# Altium schematic sheet PWMBoard.SchDoc
size B
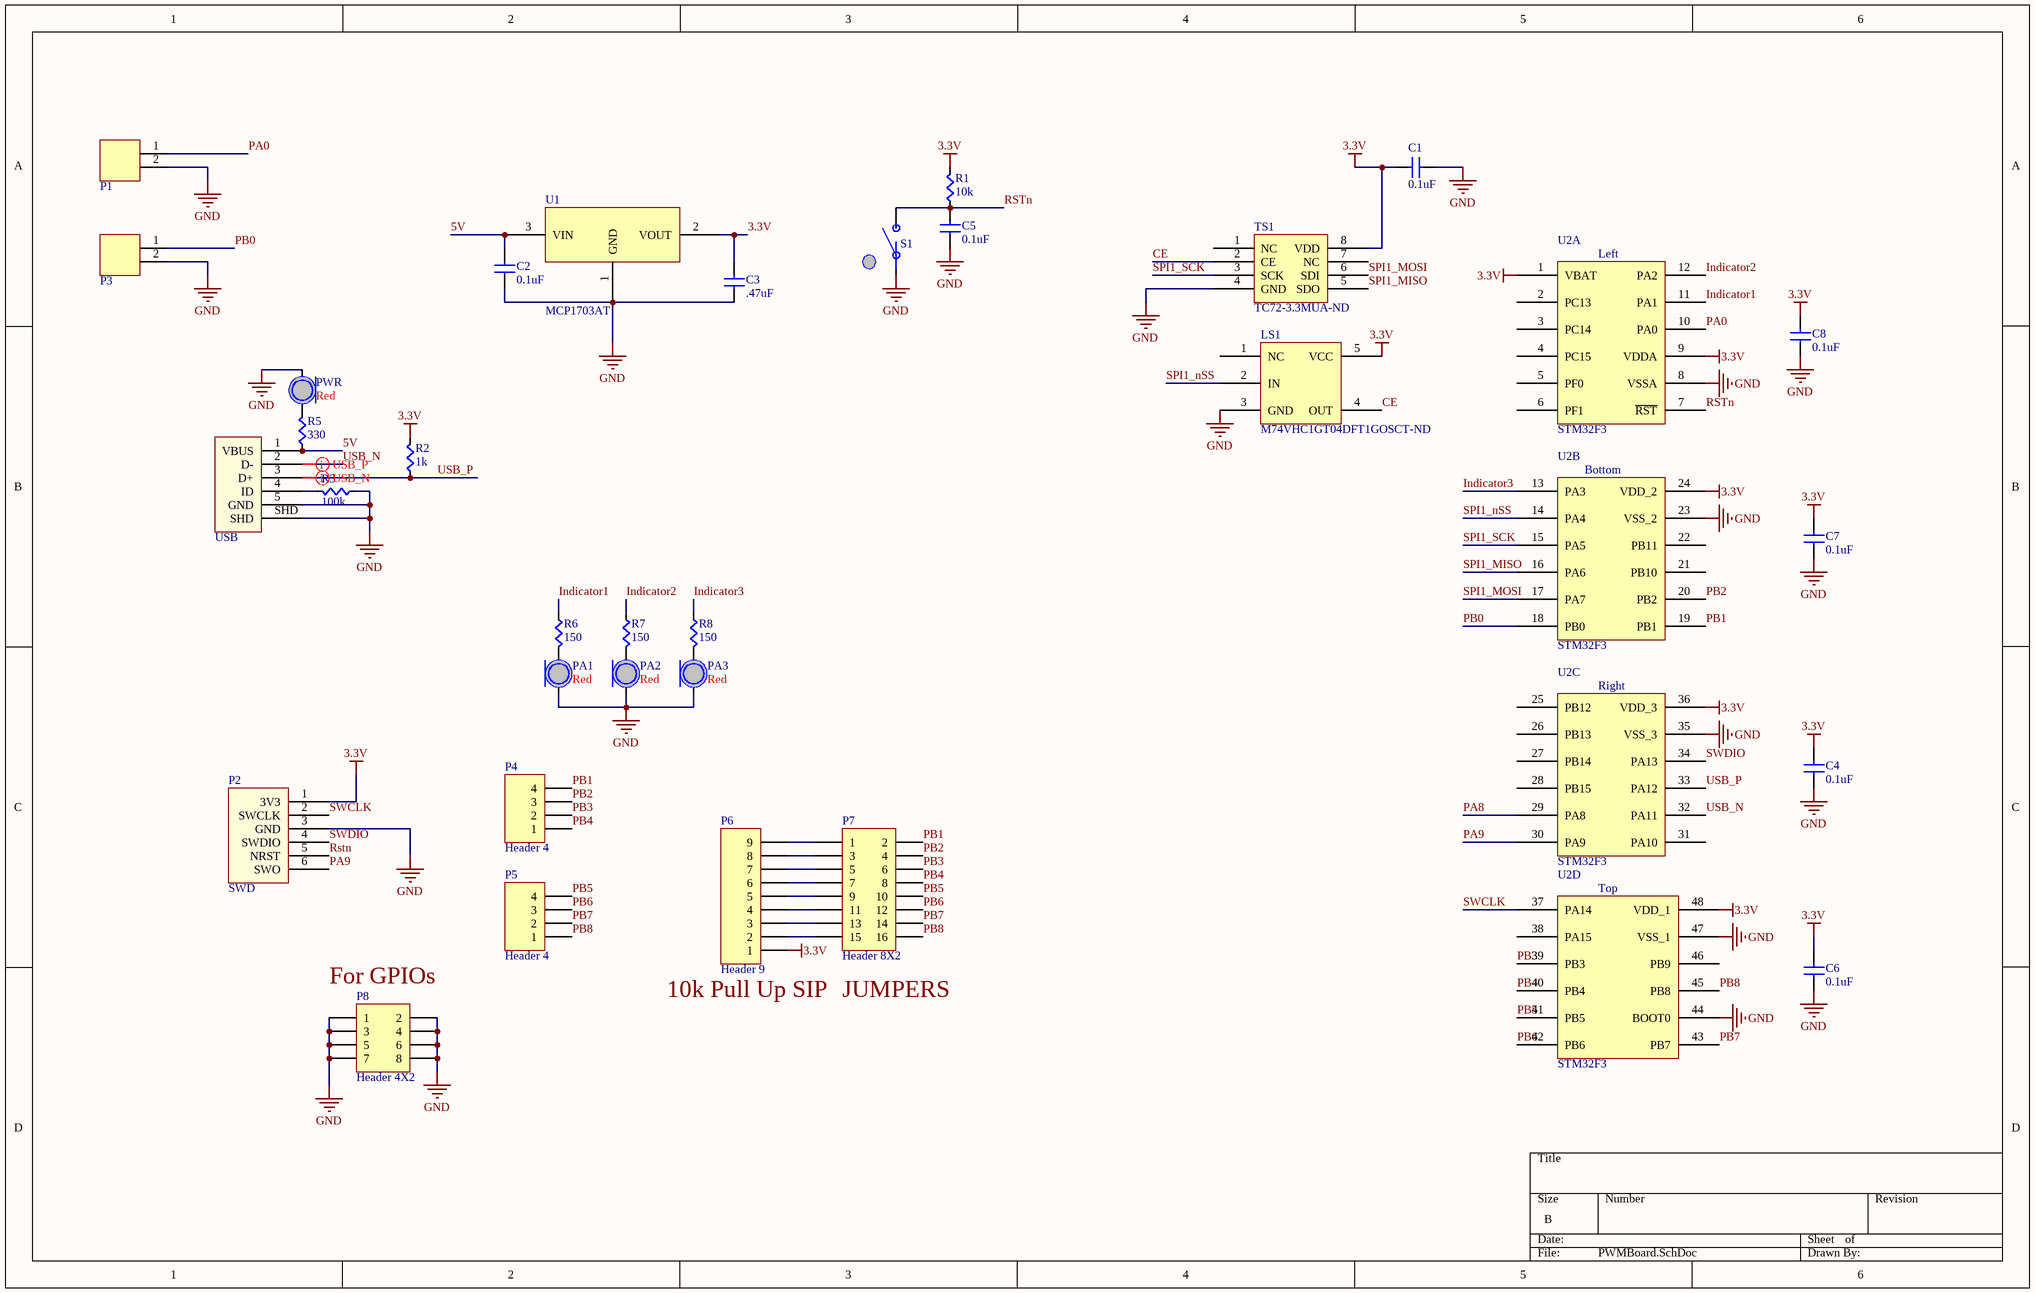
[diagram p0: PWMBoard.SchDoc]

## Parts
C1  value 0.1uF  [CAPC0603]  (hidden comment: Cap)
C2  value 0.1uF  [CAPC0603]  (hidden comment: Cap)
C3  value .47uF  [CAPC0603]  (hidden comment: Cap)
C4  value 0.1uF  [CAPC0603]  (hidden comment: Cap)
C5  value 0.1uF  [CAPC0603]  (hidden comment: Cap)
C6  value 0.1uF  [CAPC0603]  (hidden comment: Cap)
C7  value 0.1uF  [CAPC0603]  (hidden comment: Cap)
C8  value 0.1uF  [CAPC0603]  (hidden comment: Cap)
LS1  M74VHC1GT04DFT1GOSCT-ND  [SOT23127P600-8N]
P1  2-pin Horz Sherlock  [MOLEX-HDR-1X2-SHERLOCK-HORZ]  (value not drawn)
P2  SWD  [SWD_STM32]
P3  2-pin Horz Sherlock  [MOLEX-HDR-1X2-SHERLOCK-HORZ]  (value not drawn)
P4  Header 4  [HDR1X4]
P5  Header 4  [HDR1X4]
P6  Header 9  [HDR1X9]
P7  Header 8X2  [HDR2X8]
P8  Header 4X2  [HDR2X4]
PA1  Color: Red  [LED0805]  (hidden comment: LED)
PA2  Color: Red  [LED0805]  (hidden comment: LED)
PA3  Color: Red  [LED0805]  (hidden comment: LED)
PWR  Color: Red  [LED0805]  (hidden comment: LED)
R1  value 10k  [RES0603]  (hidden comment: Res)
R2  value 1k  [RES0603]  (hidden comment: Res)
R3  value 100k  [RES0603]  (hidden comment: Res)
R5  value 330  [RES0603]  (hidden comment: Res)
R6  value 150  [RES0603]  (hidden comment: Res)
R7  value 150  [RES0603]  (hidden comment: Res)
R8  value 150  [RES0603]  (hidden comment: Res)
S1  Button  [PTS645xxxxSMTR92]  (value not drawn)
TS1  TC72-3.3MUA-ND  [TC72 Temperature Sensor]
U1  MCP1703AT  [MCP1703AT-xx02EDB]
U2  STM32F3  [STM32F072CB]  (parts A,B,C,D of 4)
USB  USB Micro  [10118192-0001LF]  (value not drawn)

## Nets
3.3V: C1.1(A) C3.1(A) C4.1(A) C6.2(B) C7.1(A) C8.1(A) LS1.5(VCC) P2.1(3V3) P6.1 R1.1(A) R2.1(A) TS1.8(VDD) U1.2(VOUT) U2.1(VBAT) U2.9(VDDA) U2.24(VDD_2) U2.36(VDD_3) U2.48(VDD_1)
GND: C1.2(B) C2.2(B) C3.2(B) C4.2(B) C5.2(B) C6.1(A) C7.2(B) C8.2(B) LS1.3(GND) P1.2 P2.3(GND) P3.2 P8.1 P8.2 P8.3 P8.4 P8.5 P8.6 P8.7 P8.8 PA1.C PA2.C PA3.C PWR.C R3.2(B) S1.A TS1.4(GND) U1.1(GND) U2.8(VSSA) U2.23(VSS_2) U2.35(VSS_3) U2.44(BOOT0) U2.47(VSS_1) USB.5(GND) USB.SHD
5V: C2.1(A) R5.2(B) U1.3(VIN) USB.1(VBUS)
CE: LS1.4(OUT) TS1.2(CE)
Indicator1: R6.2(B) U2.11(PA1)
Indicator2: R7.2(B) U2.12(PA2)
Indicator3: R8.2(B) U2.13(PA3)
PA0: P1.1 U2.10(PA0)
PA8: U2.29(PA8)
PA9: P2.6(SWO) U2.30(PA9)
PB0: P3.1 U2.18(PB0)
PB1: P4.4 P7.2 U2.19(PB1)
PB2: P4.3 P7.4 U2.20(PB2)
PB3: P4.2 P7.6 U2.39(PB3)
PB4: P4.1 P7.8 U2.40(PB4)
PB5: P5.4 P7.10 U2.41(PB5)
PB6: P5.3 P7.12 U2.42(PB6)
PB7: P5.2 P7.14 U2.43(PB7)
PB8: P5.1 P7.16 U2.45(PB8)
RSTn: C5.1(A) P2.5(NRST) R1.2(B) S1.B U2.7(~{RST})
SPI1_MISO: TS1.5(SDO) U2.16(PA6)
SPI1_MOSI: TS1.6(SDI) U2.17(PA7)
SPI1_nSS: LS1.2(IN) U2.14(PA4)
SPI1_SCK: TS1.3(SCK) U2.15(PA5)
SWCLK: P2.2(SWCLK) U2.37(PA14)
SWDIO: P2.4(SWDIO) U2.34(PA13)
USB_N: U2.32(PA11) USB.2(D-)
USB_P: R2.2(B) U2.33(PA12) USB.3(D+)
NetP6_2: P6.2 P7.15
NetP6_3: P6.3 P7.13
NetP6_4: P6.4 P7.11
NetP6_5: P6.5 P7.9
NetP6_6: P6.6 P7.7
NetP6_7: P6.7 P7.5
NetP6_8: P6.8 P7.3
NetP6_9: P6.9 P7.1
NetPA1_A: PA1.A R6.1(A)
NetPA2_A: PA2.A R7.1(A)
NetPA3_A: PA3.A R8.1(A)
NetPWR_A: PWR.A R5.1(A)
NetR3_1: R3.1(A) USB.4(ID)

Not connected (* = marked no-connect by the designer): LS1 1(NC); TS1 1(NC) 7(NC); U2 2(PC13) 3(PC14) 4(PC15) 5(PF0) 6(PF1) 21(PB10) 22(PB11) 25(PB12) 26(PB13) 27(PB14) 28(PB15) 31(PA10) 38(PA15) 46(PB9)

## Layout directives
differential pair: USB_N, USB_P

## Notes on the sheet
- (near P8) For GPIOs
- 10k Pull Up SIP
- (near P7) JUMPERS
- (in symbol STM32F303CCT6, part A) Left
- (in symbol STM32F303CCT6, part B) Bottom
- (in symbol STM32F303CCT6, part C) Right
- (in symbol STM32F303CCT6, part D) Top

## Library data of the parts
LS1 = Logic Level Shifter
P1 P3 = MOLEX-HDR-1x2-SHERLOCK_RA: Header, Molex, 2mm Pitch Sherlock Header, Single Row, Horizontal, 2 Circuits, Length 3.3mm,  0353630260; Manufacturer: Molex Inc; Manufacturer Part Number: 0353630260; Supplier Part Number 1: WM18931-ND; Supplier 1: Digi-Key
P2 = SWD_STM32: SWD connector matching the pinout on STM Discovery Boards
P4 P5 = Header 4: Header, 4-Pin; LatestRevisionDate: 17-Jul-2002; LatestRevisionNote: Re-released for DXP Platform.; Publisher: Altium Limited
P6 = Header 9: Header, 9-Pin; LatestRevisionDate: 17-Jul-2002; LatestRevisionNote: Re-released for DXP Platform.; Publisher: Altium Limited
P7 = Header 8X2: Header, 8-Pin, Dual row; LatestRevisionDate: 17-Jul-2002; LatestRevisionNote: Re-released for DXP Platform.; Publisher: Altium Limited
P8 = Header 4X2: Header, 4-Pin, Dual row; LatestRevisionDate: 17-Jul-2002; LatestRevisionNote: Re-released for DXP Platform.; Publisher: Altium Limited
S1 = Button: SPST Button; Supplier 1: Digi-Key; Supplier Part Number 1: CKN9087CT-ND
TS1 = TC72 Temperature Sensor: SPI Termperature Sensor
U1 = MCP1703AT: 250 mA, 16V, Low Quiescent Current LDO Regulator; Supplier 1: Digi-Key; Supplier Part Number 1: MCP1703AT-3302E/CBCT-ND
U2 = STM32F303CCT6: IC MCU 32BIT 256KB FLASH 48LQFP; Supplier 1: Digi-Key; Supplier Part Number 1: 497-13318-ND
USB = USB Micro: USB Mini B Metal Shield SMT; Supplier 1: Digi-Key; Supplier Part Number 1: 609-4613-1-ND
C1-C8 = Cap: Supplier 1: Digi-Key
  C1 C2 C4-C8: Supplier Part Number 1: 1276-1000-1-ND
  C3: Supplier Part Number 1: 445-7465-1-ND
PA1-PA3 PWR = LED: Supplier 1: Digi-Key; Supplier Part Number 1: 754-1122-1-ND
R1-R3 R5-R8 = Res: Supplier 1: Digi-Key; Supplier Part Number 1: RMCF0603JT10K0CT-ND